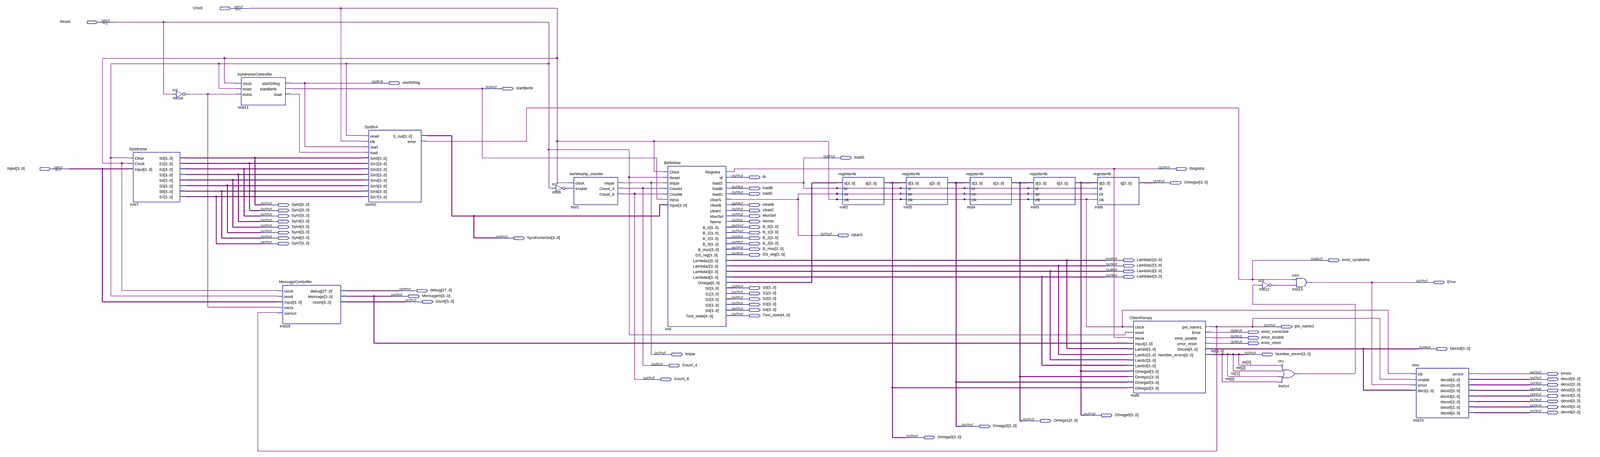
[diagram p0: schematic sheet, whole]
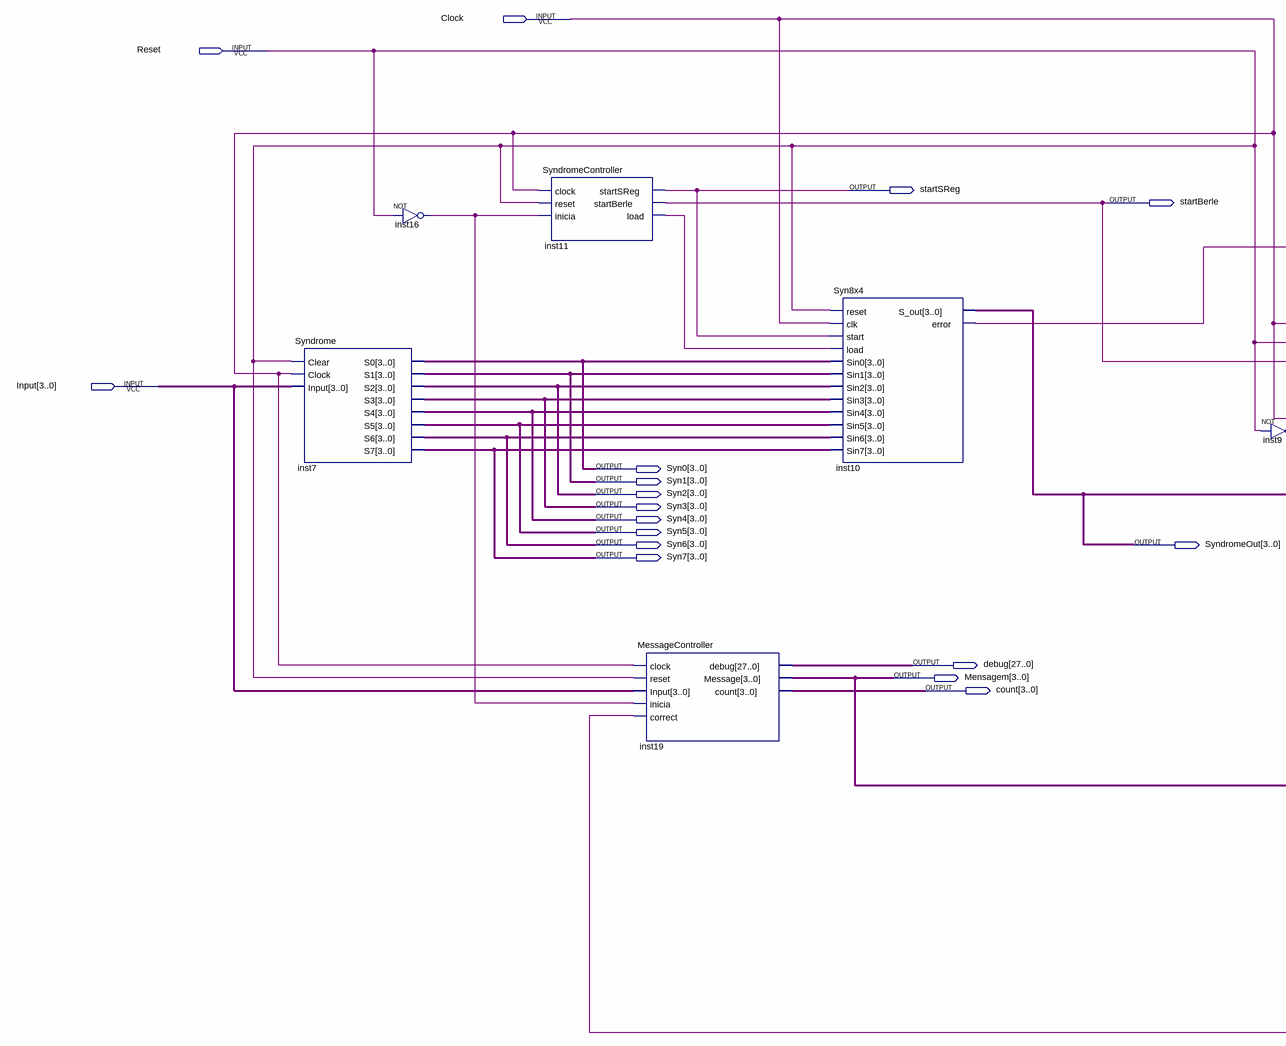
[diagram p1: schematic sheet, left part]
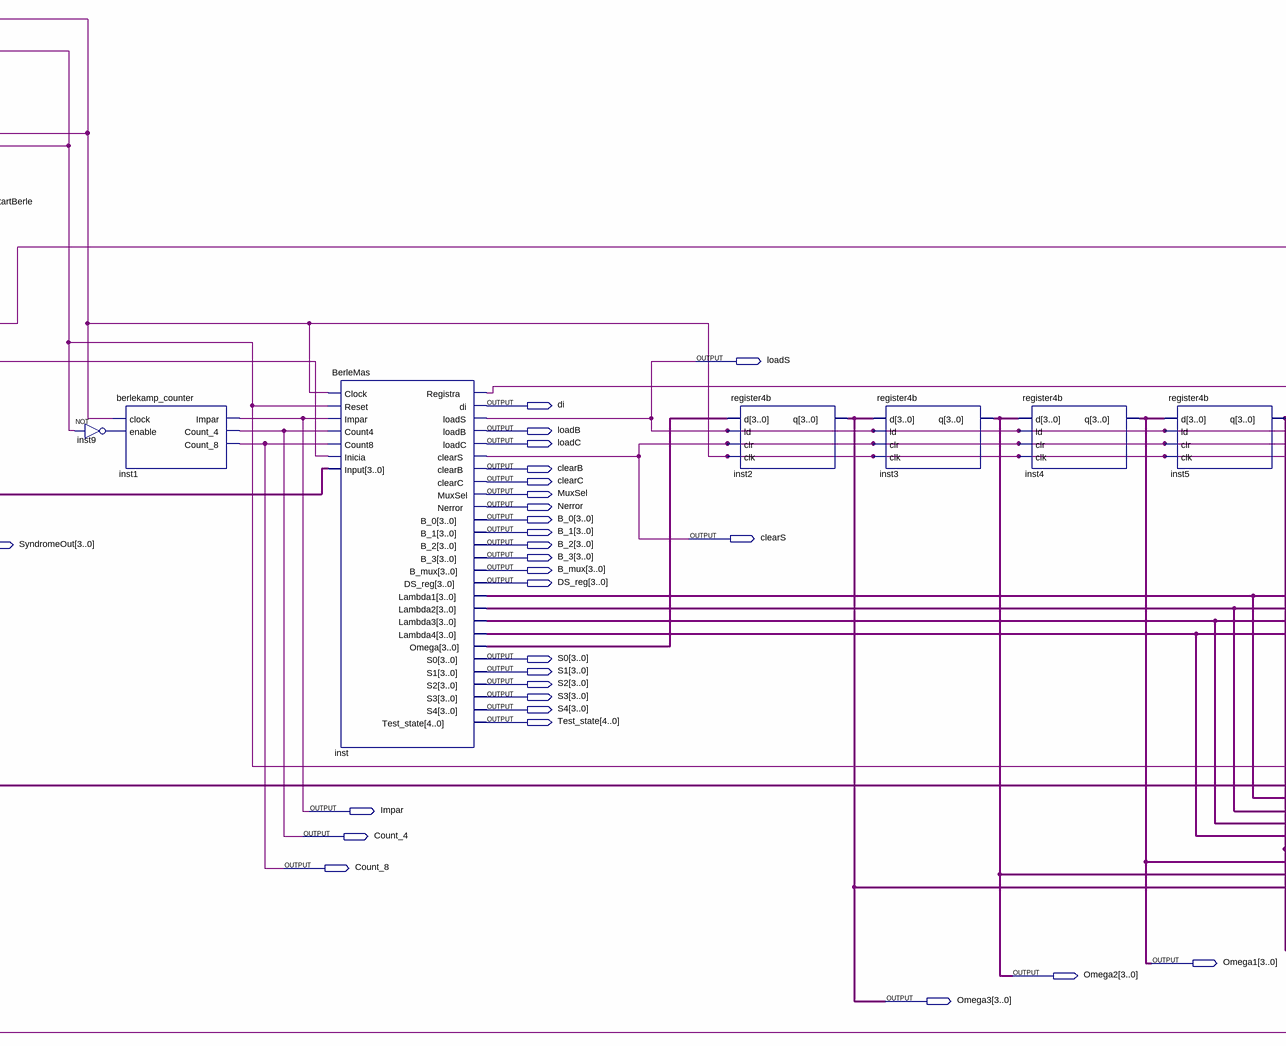
[diagram p2: schematic sheet, centre part]
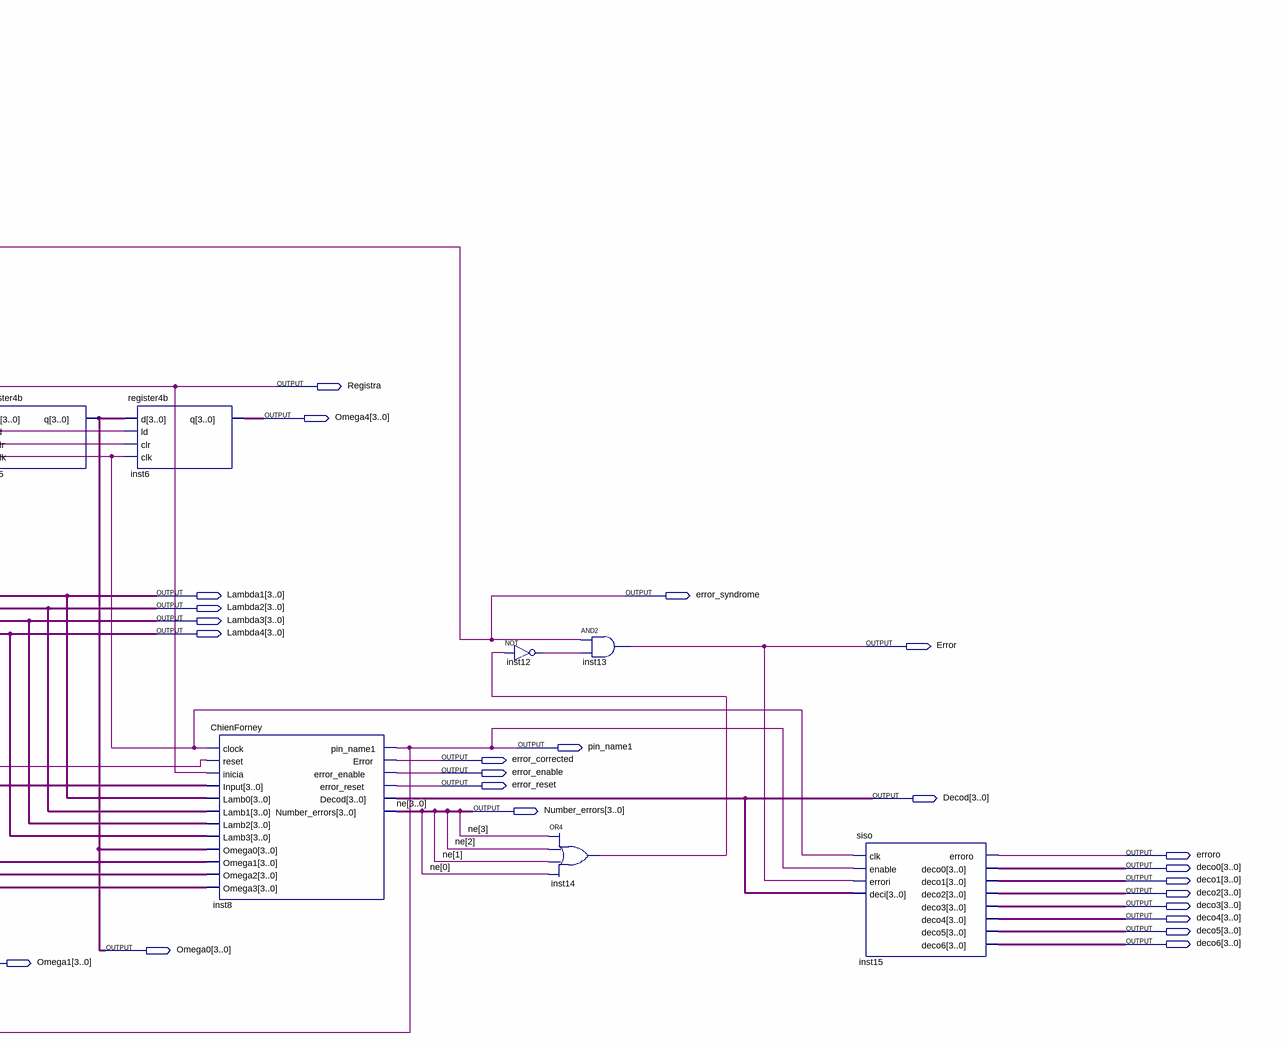
[diagram p3: schematic sheet, right part]
// Quartus schematic RSIntegration.bdf as structural Verilog: 18 symbols, 67 pins
module RSIntegration (
  input  Clock,
  input  Reset,
  input  [3:0] Input,
  output startSReg,
  output startBerle,
  output loadS,
  output Registra,
  output di,
  output [3:0] Omega4,
  output loadB,
  output loadC,
  output [3:0] Syn0,
  output clearB,
  output [3:0] Syn1,
  output clearC,
  output [3:0] Syn2,
  output MuxSel,
  output [3:0] Syn3,
  output Nerror,
  output [3:0] Syn4,
  output [3:0] B_0,
  output [3:0] Syn5,
  output [3:0] B_1,
  output clearS,
  output [3:0] Syn6,
  output [3:0] SyndromeOut,
  output [3:0] B_2,
  output [3:0] Syn7,
  output [3:0] B_3,
  output [3:0] B_mux,
  output [3:0] DS_reg,
  output [3:0] Lambda1,
  output error_syndrome,
  output [3:0] Lambda2,
  output [3:0] Lambda3,
  output [3:0] Lambda4,
  output Error,
  output [3:0] S0,
  output [27:0] debug,
  output [3:0] S1,
  output [3:0] Mensagem,
  output [3:0] S2,
  output [3:0] count,
  output [3:0] S3,
  output [3:0] S4,
  output [4:0] Test_state,
  output pin_name1,
  output error_corrected,
  output error_enable,
  output error_reset,
  output [3:0] Decod,
  output Impar,
  output [3:0] Number_errors,
  output Count_4,
  output erroro,
  output Count_8,
  output [3:0] deco0,
  output [3:0] deco1,
  output [3:0] deco2,
  output [3:0] deco3,
  output [3:0] deco4,
  output [3:0] deco5,
  output [3:0] deco6,
  output [3:0] Omega0,
  output [3:0] Omega1,
  output [3:0] Omega2,
  output [3:0] Omega3
);

  wire inst9_out, inst11_load, inst12_out, inst14_out, inst16_out;
  wire [3:0] inst_omega;

  Syndrome inst7 (
    .Clear(Reset), .Clock(Clock), .Input(Input), .S0(Syn0), .S1(Syn1), .S2(Syn2), .S3(Syn3), .S4(Syn4),
    .S5(Syn5), .S6(Syn6), .S7(Syn7));
  not inst16 (inst16_out, Reset);
  SyndromeController inst11 (
    .clock(Clock), .reset(Reset), .inicia(inst16_out), .startSReg(startSReg), .startBerle(startBerle),
    .load(inst11_load));
  MessageController inst19 (
    .clock(Clock), .reset(Reset), .Input(Input), .inicia(inst16_out), .correct(pin_name1), .debug(debug),
    .Message(Mensagem), .count(count));
  Syn8x4 inst10 (
    .reset(Reset), .clk(Clock), .start(startSReg), .load(inst11_load), .Sin0(Syn0), .Sin1(Syn1), .Sin2(Syn2),
    .Sin3(Syn3), .Sin4(Syn4), .Sin5(Syn5), .Sin6(Syn6), .Sin7(Syn7), .S_out(SyndromeOut),
    .error(error_syndrome));
  berlekamp_counter inst1 (.clock(Clock), .enable(inst9_out), .Impar(Impar), .Count_4(Count_4), .Count_8(Count_8));
  not inst9 (inst9_out, Reset);
  BerleMas inst (
    .Clock(Clock), .Reset(Reset), .Impar(Impar), .Count4(Count_4), .Count8(Count_8), .Inicia(startBerle),
    .Input(SyndromeOut), .Registra(Registra), .di(di), .loadS(loadS), .loadB(loadB), .loadC(loadC),
    .clearS(clearS), .clearB(clearB), .clearC(clearC), .MuxSel(MuxSel), .Nerror(Nerror), .B_0(B_0),
    .B_1(B_1), .B_2(B_2), .B_3(B_3), .B_mux(B_mux), .DS_reg(DS_reg), .Lambda1(Lambda1), .Lambda2(Lambda2),
    .Lambda3(Lambda3), .Lambda4(Lambda4), .Omega(inst_omega), .S0(S0), .S1(S1), .S2(S2), .S3(S3), .S4(S4),
    .Test_state(Test_state));
  register4b inst2 (.d(inst_omega), .ld(loadS), .clr(clearS), .clk(Clock), .q(Omega3));
  register4b inst3 (.d(Omega3), .ld(loadS), .clr(clearS), .clk(Clock), .q(Omega2));
  register4b inst4 (.d(Omega2), .ld(loadS), .clr(clearS), .clk(Clock), .q(Omega1));
  register4b inst5 (.d(Omega1), .ld(loadS), .clr(clearS), .clk(Clock), .q(Omega0));
  register4b inst6 (.d(Omega0), .ld(loadS), .clr(clearS), .clk(Clock), .q(Omega4));
  ChienForney inst8 (
    .clock(Clock), .reset(Reset), .inicia(Registra), .Input(Mensagem), .Lamb0(Lambda1), .Lamb1(Lambda2),
    .Lamb2(Lambda3), .Lamb3(Lambda4), .Omega0(Omega0), .Omega1(Omega1), .Omega2(Omega2), .Omega3(Omega3),
    .pin_name1(pin_name1), .Error(error_corrected), .error_enable(error_enable), .error_reset(error_reset),
    .Decod(Decod), .Number_errors(Number_errors));
  not inst12 (inst12_out, inst14_out);
  or inst14 (inst14_out, Number_errors[3], Number_errors[2], Number_errors[1], Number_errors[0]);
  and inst13 (Error, error_syndrome, inst12_out);
  siso inst15 (
    .clk(Clock), .enable(pin_name1), .errori(Error), .deci(Decod), .erroro(erroro), .deco0(deco0),
    .deco1(deco1), .deco2(deco2), .deco3(deco3), .deco4(deco4), .deco5(deco5), .deco6(deco6));

  // Other names for the same wires on the sheet: ne[3:0] = Number_errors
endmodule
